# EAGLE schematic NSE2022_ROCKETCONTROLLER_ver0 (EAGLE 9.6.0)
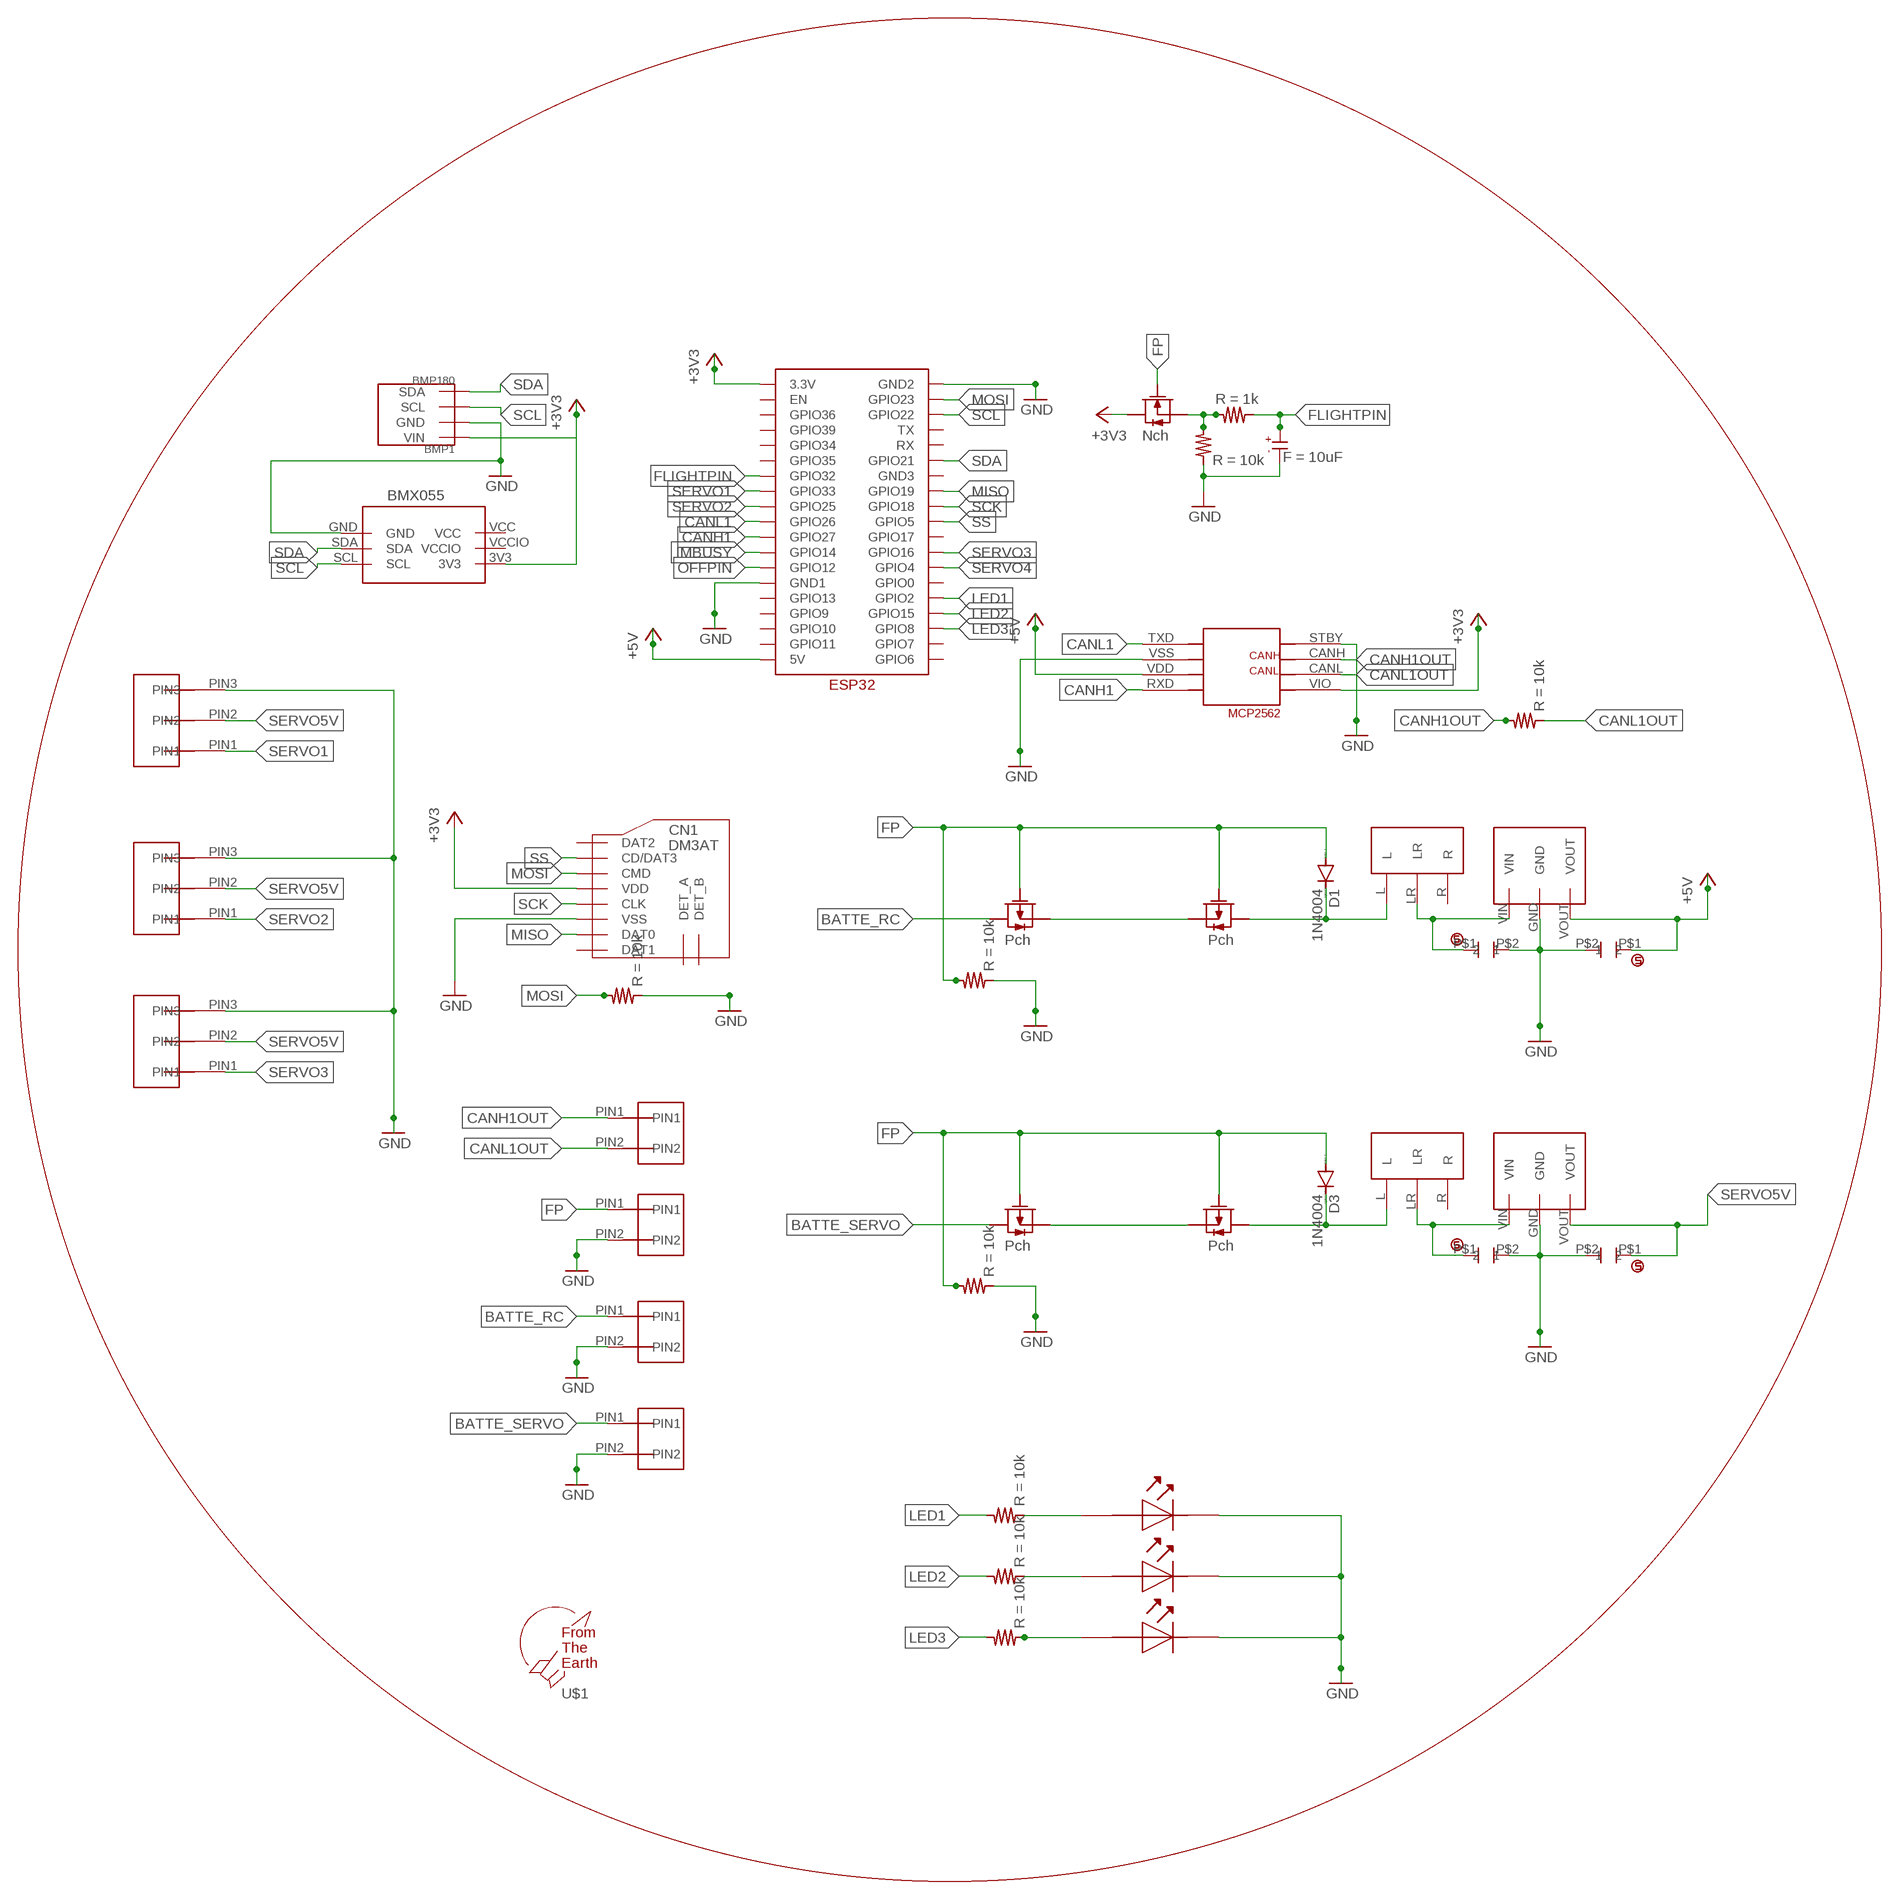
[diagram p0: schematic, sheet 1]

## Parts
BMP1  BMP180  [GY-68]
BMX1  BMX055  [BMX055]
C1  CAPACITOR-ELECTROLYTIC_1  [CAPACITOR-ELECTROLYTIC_1]
CERAMIC_CAPACITOR3  CERAMIC_CAPACITOR  [CERAMIC_CAPACITOR]
CERAMIC_CAPACITOR4  CERAMIC_CAPACITOR  [CERAMIC_CAPACITOR]
CERAMIC_CAPACITOR5  CERAMIC_CAPACITOR  [CERAMIC_CAPACITOR]
CERAMIC_CAPACITOR6  CERAMIC_CAPACITOR  [CERAMIC_CAPACITOR]
CN1  DM3AT  [DM3AT]
D1  1N4004  [DO41-10]
D3  1N4004  [DO41-10]
R2  RESISTER  [REGISTER]
R3  RESISTER  [REGISTER]
R4  RESISTER  [REGISTER]
R5  RESISTER  [REGISTER]
R9  RESISTER  [REGISTER]
R10  RESISTER  [REGISTER]
R12  RESISTER  [REGISTER]
R14  RESISTER  [REGISTER]
R15  RESISTER  [REGISTER]
SRIDE_SWTCH1  SRIDE_SWITCH  [SRIDE_SWITCH]
SRIDE_SWTCH2  SRIDE_SWITCH  [SRIDE_SWITCH]
U$1  F.T.E.LOGO  [LOGO]
U$4  ESP32  [ESP32]
U$8  2SK4017-NCH  [2SK4017]
U$12  2SJ681-PCH  [2SJ681]
U$13  2SJ681-PCH  [2SJ681]
U$14  M78AR05-1  [M78AR05-1]
U$18  2PIN  [2PIN]
U$19  2PIN  [2PIN]
U$20  2PIN  [2PIN]
U$21  2PIN  [2PIN]
U$27  MCP2562  [MCP2562]
U$30  2SJ681-PCH  [2SJ681]
U$31  2SJ681-PCH  [2SJ681]
U$32  M78AR05-1  [M78AR05-1]
U$42  3PIN  [3PIN]
U$43  3PIN  [3PIN]
U$44  3PIN  [3PIN]
U$63  LED  [LED]
U$64  LED  [LED]
U$69  LED  [LED]

## Nets
+3V3: BMP1.P1(VIN) BMX1.3V3 CN1.VDD U$4.3.3V U$8.DRAIN U$27.VIO
+5V: CERAMIC_CAPACITOR5.P$1 U$4.5V U$27.VDD U$32.VOUT
BATTE_RC: U$20.PIN1 U$30.DRAIN
BATTE_SERVO: U$13.DRAIN U$21.PIN1
CANH1: U$4.GPIO27 U$27.RXD
CANH1OUT: R3.B U$18.PIN1 U$27.CANH
CANL1: U$4.GPIO26 U$27.TXD
CANL1OUT: R3.A U$18.PIN2 U$27.CANL
FLIGHTPIN: C1.KS R10.A U$4.GPIO32
FP: D1.A D3.A R2.B R5.B U$8.GATE U$12.GATE U$13.GATE U$19.PIN1 U$30.GATE U$31.GATE
GND: BMP1.P2(GND) BMX1.GND C1.AN CERAMIC_CAPACITOR3.P$2 CERAMIC_CAPACITOR4.P$2 CERAMIC_CAPACITOR5.P$2 CERAMIC_CAPACITOR6.P$2 CN1.VSS R2.A R4.A R5.A R9.A U$4.GND1 U$14.GND U$19.PIN2 U$20.PIN2 U$21.PIN2 U$27.STBY U$27.VSS U$32.GND U$42.PIN3 U$43.PIN3 U$44.PIN3 U$63.PLUS(OUT) U$64.PLUS(OUT) U$69.PLUS(OUT)
IMBUSY: U$4.GPIO14
LED1: R12.B U$4.GPIO2
LED2: R14.B U$4.GPIO15
LED3: R15.B U$4.GPIO8
MISO: CN1.DAT0 U$4.GPIO19
MOSI: CN1.CMD R4.B U$4.GPIO23
N$1: U$4.GND2 ; supply symbol labelled GND
N$2: U$12.SOURCE U$13.SOURCE
N$5: R9.B R10.B U$8.SOURCE
N$6: CERAMIC_CAPACITOR4.P$1 SRIDE_SWTCH1.LR U$14.VIN
N$10: D1.C SRIDE_SWTCH2.L U$31.DRAIN
N$11: D3.C SRIDE_SWTCH1.L U$12.DRAIN
N$15: R12.A U$63.MINUS(IN)
N$16: R14.A U$64.MINUS(IN)
N$17: R15.A U$69.MINUS(IN)
N$22: U$30.SOURCE U$31.SOURCE
N$24: CERAMIC_CAPACITOR6.P$1 SRIDE_SWTCH2.LR U$32.VIN
OFFPIN: U$4.GPIO12
SCK: CN1.CLK U$4.GPIO18
SCL: BMP1.P3(SCL) BMX1.SCL U$4.GPIO22
SDA: BMP1.P4(SDA) BMX1.SDA U$4.GPIO21
SERVO1: U$4.GPIO33 U$42.PIN1
SERVO2: U$4.GPIO25 U$43.PIN1
SERVO3: U$4.GPIO16 U$44.PIN1
SERVO4: U$4.GPIO4
SERVO5V: CERAMIC_CAPACITOR3.P$1 U$14.VOUT U$42.PIN2 U$43.PIN2 U$44.PIN2
SS: CN1.CD/DAT3 U$4.GPIO5
Unconnected: CN1.DAT1 CN1.DAT2 CN1.DET_A CN1.DET_B SRIDE_SWTCH1.R SRIDE_SWTCH2.R U$4.EN U$4.GND3 U$4.GPIO0 U$4.GPIO6 U$4.GPIO7 U$4.GPIO9 U$4.GPIO10 U$4.GPIO11 U$4.GPIO13 U$4.GPIO17 U$4.GPIO34 U$4.GPIO35 U$4.GPIO36 U$4.GPIO39 U$4.RX U$4.TX

## Power pins joined to a net without a drawn wire
VCC: BMX1.VCC
VCCIO: BMX1.VCCIO

## Library data of the parts
BMP1 = BMP180:BMP180
BMX1 = BMX055:BMX055
C1 = normal capacitor:CAPACITOR-ELECTROLYTIC_1; F: 10uF
CERAMIC_CAPACITOR3-CERAMIC_CAPACITOR6 = capacitor:CERAMIC_CAPACITOR: ceramic_capacitor
CN1 = microSD:DM3AT
D1 D3 = diode:1N4004: DIODE general purpose rectifier, 1 A
R2-R5 R9 R12 R14 R15 = normal register:RESISTER; R: 10k
R10 = normal register:RESISTER; R: 1k
SRIDE_SWTCH1 SRIDE_SWTCH2 = Switches:SRIDE_SWITCH
U$1 = logo:F.T.E.LOGO
U$4 = ESP32:ESP32
U$8 = MOSFET:2SK4017-NCH
U$12 U$13 U$30 U$31 = MOSFET:2SJ681-PCH
U$14 U$32 = M78AR05-1:M78AR05-1
U$18-U$21 = 2PIN:2PIN
U$27 = MCP2562:MCP2562
U$42-U$44 = 3PIN:3PIN
U$63 U$64 U$69 = LEDkato:LED